# EAGLE design IMU (EAGLE 9.6.2)
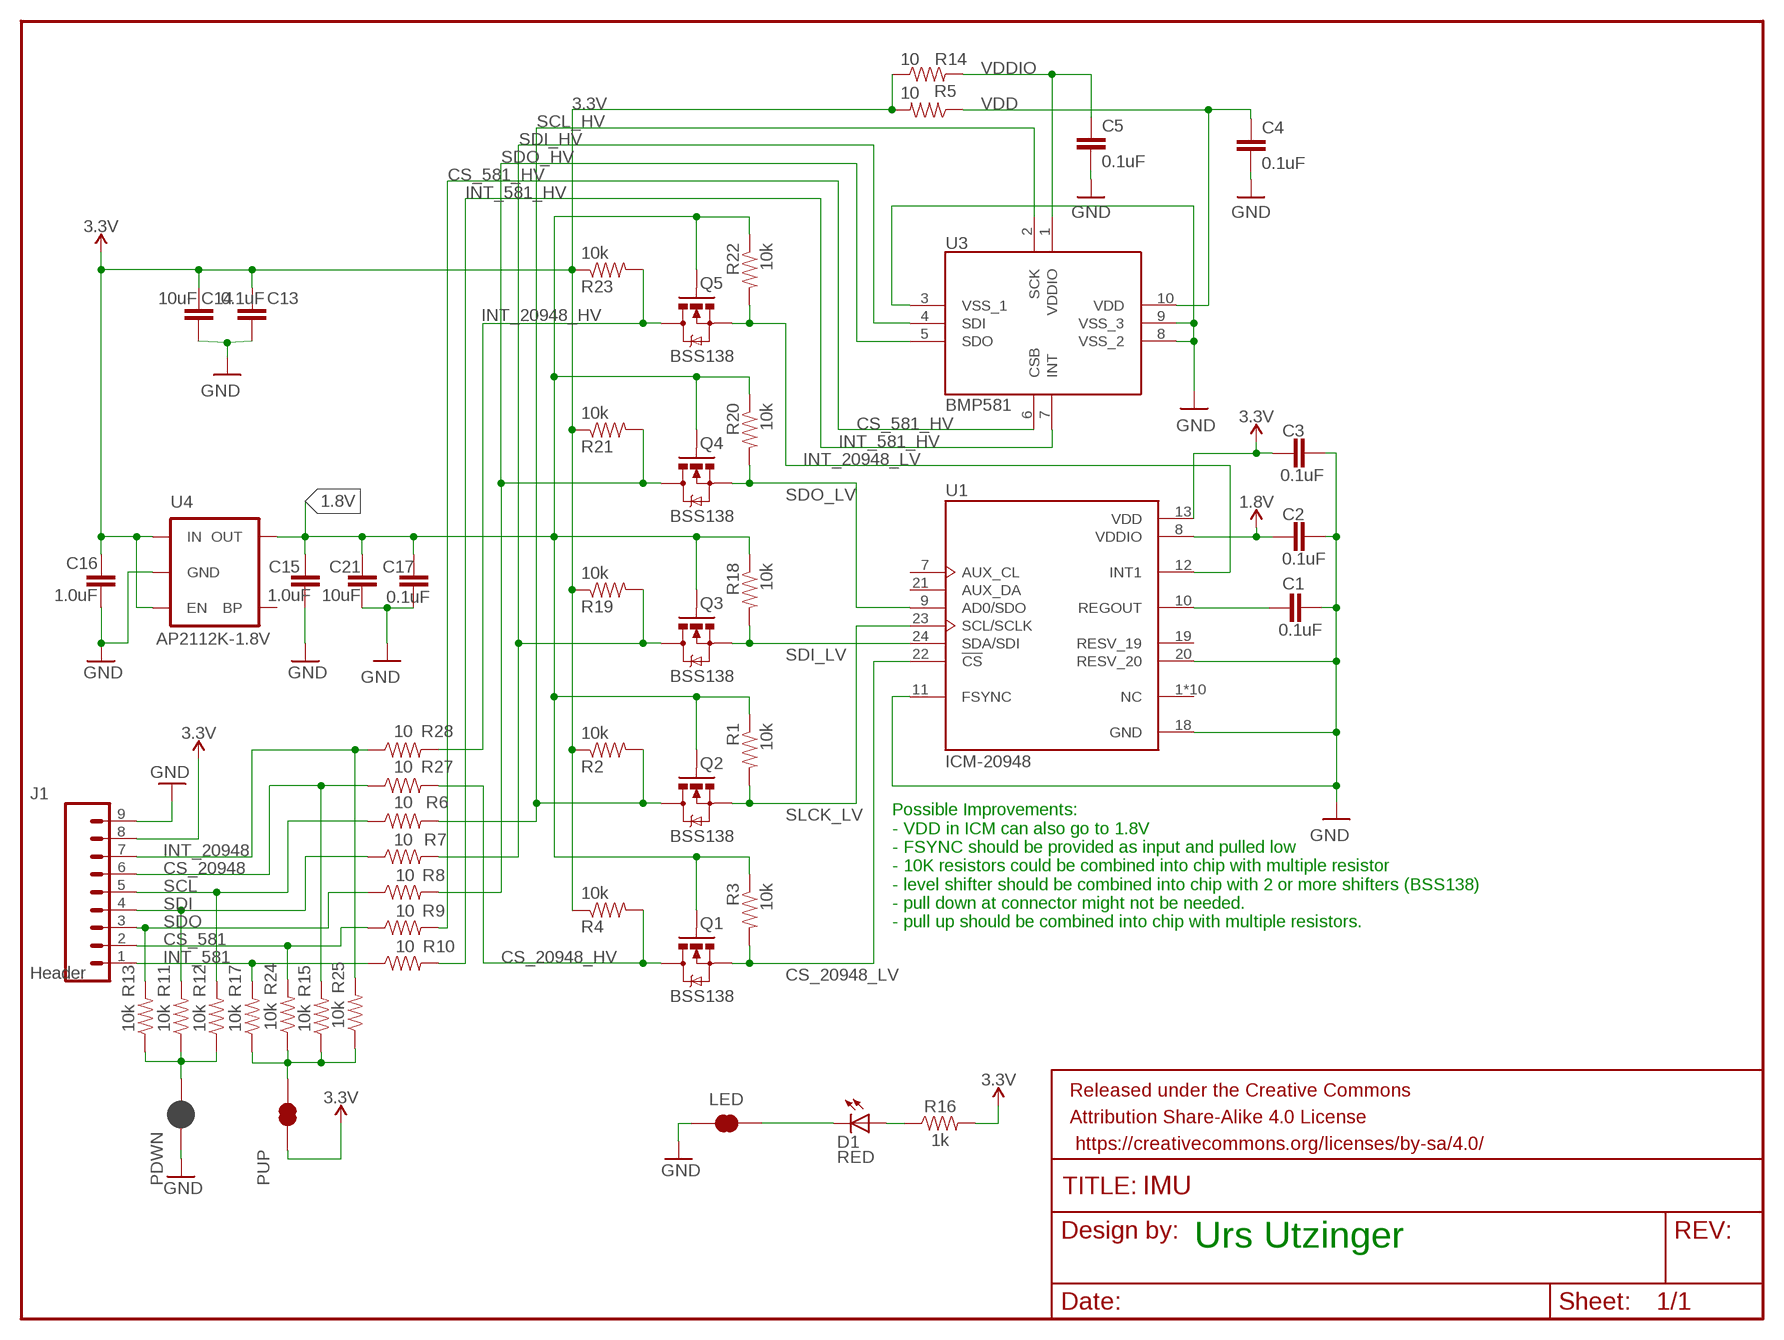
[diagram p0: schematic, sheet 1]

## Parts
C1  0.1uF  0.1UF-0603-25V-(+80/-20%)  [0603]
C2  0.1uF  0.1UF-0603-25V-(+80/-20%)  [0603]
C3  0.1uF  0.1UF-0603-25V-(+80/-20%)  [0603]
C4  0.1uF  0.1UF-0603-25V-(+80/-20%)  [0603]
C5  0.1uF  0.1UF-0603-25V-(+80/-20%)  [0603]
C13  0.1uF  0.1UF-0603-25V-(+80/-20%)  [0603]
C14  10uF  10UF-0603-6.3V-20%  [0603@1]
C15  1.0uF  1.0UF-0603-16V-10%  [0603]
C16  1.0uF  1.0UF-0603-16V-10%  [0603]
C17  0.1uF  0.1UF-0603-25V-(+80/-20%)  [0603]
C21  10uF  10UF-0603-6.3V-20%  [0603@1]
D1  RED  LED-RED0603  [LED-0603]
FRAME1  FRAME-LETTERNO_PACKAGE  [DUMMY]
J1  Header  CONN_09  [1X09]
LED  LED ENABLE  JUMPER-SMT_2_NC_TRACE_SILK  [SMT-JUMPER_2_NC_TRACE_SILK]
PDWN  JUMPER-SMT_2_NC_PASTE_SILK  [SMT-JUMPER_2_NC_PASTE_SILK]
PUP  JUMPER-SMT_2_NC_TRACE_SILK  [SMT-JUMPER_2_NC_TRACE_SILK]
Q1  BSS138  SPARKFUN_MOSFET-NCHANNELSMD  [SPARKFUN_SOT23-3]
Q2  BSS138  SPARKFUN_MOSFET-NCHANNELSMD  [SPARKFUN_SOT23-3]
Q3  BSS138  SPARKFUN_MOSFET-NCHANNELSMD  [SPARKFUN_SOT23-3]
Q4  BSS138  SPARKFUN_MOSFET-NCHANNELSMD  [SPARKFUN_SOT23-3]
Q5  BSS138  SPARKFUN_MOSFET-NCHANNELSMD  [SPARKFUN_SOT23-3]
R1  10k  10KOHM-0603-1/10W-1%  [0603]
R2  10k  10KOHM-0603-1/10W-1%  [0603]
R3  10k  10KOHM-0603-1/10W-1%  [0603]
R4  10k  10KOHM-0603-1/10W-1%  [0603]
R5  10  10OHM-0603-1/10W-5%  [0603]
R6  10  10OHM-0603-1/10W-1%  [0603]
R7  10  10OHM-0603-1/10W-1%  [0603]
R8  10  10OHM-0603-1/10W-1%  [0603]
R9  10  10OHM-0603-1/10W-1%  [0603]
R10  10  10OHM-0603-1/10W-1%  [0603]
R11  10k  10KOHM-0603-1/10W-1%  [0603]
R12  10k  10KOHM-0603-1/10W-1%  [0603]
R13  10k  10KOHM-0603-1/10W-1%  [0603]
R14  10  10OHM-0603-1/10W-5%  [0603]
R15  10k  10KOHM-0603-1/10W-1%  [0603]
R16  1k  1KOHM-0603-1/10W-1%  [0603]
R17  10k  10KOHM-0603-1/10W-1%  [0603]
R18  10k  10KOHM-0603-1/10W-1%  [0603]
R19  10k  10KOHM-0603-1/10W-1%  [0603]
R20  10k  10KOHM-0603-1/10W-1%  [0603]
R21  10k  10KOHM-0603-1/10W-1%  [0603]
R22  10k  10KOHM-0603-1/10W-1%  [0603]
R23  10k  10KOHM-0603-1/10W-1%  [0603]
R24  10k  10KOHM-0603-1/10W-1%  [0603]
R25  10k  10KOHM-0603-1/10W-1%  [0603]
R27  10  10OHM-0603-1/10W-1%  [0603]
R28  10  10OHM-0603-1/10W-1%  [0603]
U1  ICM-20948  [QFN40P300X300X105-24N]
U3  BMP581  [BMP581]
U4  AP2112K-1.8V  AP2122K-1.8TRG1SMD  [SPARKFUN-POWERIC_SOT23-5]

## Nets
1.8V: C2.1 C15.2 C17.1 C21.1 Q1.1(G) Q2.1(G) Q3.1(G) Q4.1(G) Q5.1(G) R1.1 R3.1 R18.1 R20.1 R22.1 U1.8(VDDIO) U4.5(OUT)
3.3V: C3.1 C13.1 C14.1 C16.2 J1.8 PUP.1 R2.1 R4.1 R5.2 R14.1 R16.2 R19.1 R21.1 R23.1 U1.13(VDD) U4.1(IN) U4.3(EN)
CS_581: J1.2 R9.1 R24.2
CS_581_HV: R9.2 U3.6(CSB)
CS_20948: J1.6 R15.2 R27.1
CS_20948_HV: Q1.3(D) R4.2 R27.2
CS_20948_LV: Q1.2(S) R3.2 U1.22(!CS)
GND: C1.2 C2.2 C3.2 C4.2 C5.2 C13.2 C14.2 C15.1 C16.1 C17.2 C21.2 J1.9 LED.1 PDWN.1 U1.11(FSYNC) U1.18(GND) U1.20(RESV_20) U3.3(VSS_1) U3.8(VSS_2) U3.9(VSS_3) U4.2(GND)
INT_581: J1.1 R10.1 R17.2
INT_581_HV: R10.2 U3.7(INT)
INT_20948: J1.7 R25.2 R28.1
INT_20948_HV: Q5.3(D) R23.2 R28.2
INT_20948_LV: Q5.2(S) R22.2 U1.12(INT1)
N$3: C1.1 U1.10(REGOUT)
N$26: D1.A R16.1
N$28: D1.C LED.2
N$29: PDWN.2 R11.1 R12.1 R13.1
N$30: PUP.2 R15.1 R17.1 R24.1 R25.1
SCL: J1.5 R6.1 R12.2
SCL_HV: Q2.3(D) R2.2 R6.2 U3.2(SCK)
SDI: J1.4 R7.1 R11.2
SDI_HV: Q3.3(D) R7.2 R19.2 U3.4(SDI)
SDI_LV: Q3.2(S) R18.2 U1.24(SDA/SDI)
SDO: J1.3 R8.1 R13.2
SDO_HV: Q4.3(D) R8.2 R21.2 U3.5(SDO)
SDO_LV: Q4.2(S) R20.2 U1.9(AD0/SDO)
SLCK_LV: Q2.2(S) R1.2 U1.23(SCL/SCLK)
VDD: C4.1 R5.1 U3.10(VDD)
VDDIO: C5.1 R14.2 U3.1(VDDIO)
Unconnected: U1.1(NC) U1.2(NC) U1.3(NC) U1.4(NC) U1.5(NC) U1.6(NC) U1.7(AUX_CL) U1.14(NC) U1.15(NC) U1.16(NC) U1.17(NC) U1.19(RESV_19) U1.21(AUX_DA) U4.4(BP)

## Notes on the sheet
- Possible Improvements:
  - VDD in ICM can also go to 1.8V
  - FSYNC should be provided as input and pulled low
  - 10K resistors could be combined into chip with multiple resistor
  - level shifter should be combined into chip with 2 or more shifters (BSS138)
  - pull down at connector might not be needed.
  - pull up should be combined into chip with multiple resistors.
- Urs Utzinger

## Library data of the parts
C1-C5 C13 C17 = SparkFun-Capacitors:0.1UF: 0.1µF ceramic capacitors A capacitor is a passive two-terminal electrical component used to store electrical energy temporarily in an electric field.; PROD_ID: CAP-00810
C14 C21 = SparkFun-Capacitors:10UF: 10.0µF ceramic capacitors A capacitor is a passive two-terminal electrical component used to store electrical energy temporarily in an electric field.; PROD_ID: CAP-11015
C15 C16 = SparkFun-Capacitors:1.0UF: 1µF ceramic capacitors A capacitor is a passive two-terminal electrical component used to store electrical energy temporarily in an electric field.; PROD_ID: CAP-00868
D1 = SparkFun-LED:LED-RED: Assorted Red LEDs LilyPad 1206- DIO-09912 1206- DIO-00809 0603- DIO-00819; PROD_ID: DIO-00819
FRAME1 = SparkFun-Aesthetics:FRAME-LETTER: Schematic Frame - Letter Standard 8.5x11 US Letter frame; DESIGNER: Nobody; VERSION: v01
J1 = SparkFun-Connectors:CONN_09: Multi connection point. Often used as Generic Header-pin footprint for 0.1 inch spaced/style header connections On any of the 0.1 inch spaced packages, you can populate with these: Break Away Headers - Straight <https://www.sparkfun.com/products/116> (PRT-00116) Break Away Male Headers - Right Angle <https://www.sparkfun.com/products/553> (PRT-00553) Female Headers <https://www.sparkfun.com/products/115> (PRT-00115) Break Away Headers - Machine Pin <https://www.sparkfun.com/products/117> (PRT-00117) Break Away Female Headers - Swiss Machine Pin <https://www.sparkfun.com/products/743> (PRT-00743) For SCREWTERMINALS and SPRING TERMINALS visit here: Screw Terimnals on SparkFun.com <https://www.sparkfun.com/search/results?term=Screw+Terminals> (5mm/3.5mm/2.54mm spacing) This device is also useful as a general connection point to wire up your design to another part of your project. Our various solder wires solder well into these plated through hole pads. Hook-Up Wire - Assortment (Stranded, 22 AWG) <https://www.sparkfun.com/products/11375> (PRT-11375) Hook-Up Wire - Assortment (Solid Core, 22 AWG) <https://www.sparkfun.com/products/11367> (PRT-11367) View the entire wire category on our website here <https://www.sparkfun.com/categories/141> Special notes: Molex polarized connector foot print use with SKU : PRT-08231 with associated crimp pins and housings. 1MM SMD Version SKU: PRT-10208 NOTES ON THE VARIANTS LOCK and LOCK_LONGPADS... This footprint was designed to help hold the alignment of a through-hole component (i.e. 6-pin header) while soldering it into place. You may notice that each hole has been shifted either up or down by 0.005 of an inch from it's more standard position (which is a perfectly straight line). This slight alteration caused the pins (the squares in the middle) to touch the edges of the holes. Because they are alternating, it causes a "brace" to hold the component in place. 0.005 has proven to be the perfect amount of "off-center" position when using our standard breakaway headers. Although looks a little odd when you look at the bare footprint, once you have a header in there, the alteration is very hard to notice. Also,if you push a header all the way into place, it is covered up entirely on the bottom side.
LED PUP = SparkFun-Jumpers:JUMPER-SMT_2_NC_TRACE: Normally closed trace jumper This jumper has a trace between two pads so it's normally closed (NC). Use a razor knife to open the connection. For best results follow the IPC guidelines for cutting traces: Cutout at least 0.063 mm (0.005 in). Remove all loose material to clean up the cut area. Seal the cut with an approved epoxy. Reapply solder to reclose the connection.
PDWN = SparkFun-Jumpers:JUMPER-SMT_2_NC_PASTE: Normally closed solder jumper This jumper has an aperture in the stencil to allow solder paste to bridge the split in the wire so it's normally closed (NC). Wick off the solder to open the connection. Reapply solder to reclose the connection.
Q1-Q5 = BSS138:SPARKFUN_MOSFET-NCHANNEL
R1-R4 R11-R13 R15 R17-R25 = SparkFun-Resistors:10KOHM: 10kΩ resistor A resistor is a passive two-terminal electrical component that implements electrical resistance as a circuit element. Resistors act to reduce current flow, and, at the same time, act to lower voltage levels within circuits. - Wikipedia; PROD_ID: RES-00824
R5 R14 = SparkFun-Resistors:10OHM: 10Ω resistor A resistor is a passive two-terminal electrical component that implements electrical resistance as a circuit element. Resistors act to reduce current flow, and, at the same time, act to lower voltage levels within circuits. - Wikipedia; PROD_ID: RES-09834
R6-R10 R27 R28 = SparkFun-Resistors:10OHM: 10Ω resistor A resistor is a passive two-terminal electrical component that implements electrical resistance as a circuit element. Resistors act to reduce current flow, and, at the same time, act to lower voltage levels within circuits. - Wikipedia; PROD_ID: RES-12581
R16 = SparkFun-Resistors:1KOHM: 1kΩ resistor A resistor is a passive two-terminal electrical component that implements electrical resistance as a circuit element. Resistors act to reduce current flow, and, at the same time, act to lower voltage levels within circuits. - Wikipedia; PROD_ID: RES-07856
U1 = ICM-20948:ICM-20948: Accelerometer, Gyroscope, Magnetometer, 9 Axis Sensor I²C, SPI Output; MANUFACTURER: TDK InvenSense; MAXIMUM_PACKAGE_HEIGHT: 1.05 mm; PARTREV: 1.3; STANDARD: IPC 7351B
U3 = BMP581:BMP581: Pressure Sensor 4.35PSI ~ 18.13PSI (30kPa ~ 125kPa) Absolute 10-WFLGA Source: Datasheet <https://www.bosch-sensortec.com/media/boschsensortec/downloads/datasheets/bst-bmp581-ds004.pdf>; DESCRIPTION: Pressure Sensor 4.35PSI ~ 18.13PSI (30kPa ~ 125kPa) Absolute 10-WFLGA; HEIGHT: 0.8mm; MANUFACTURER_NAME: BOSCH; MANUFACTURER_PART_NUMBER: BMP581; MOUSER_PART_NUMBER: 262-BMP581; MOUSER_PRICE-STOCK: https://www.mouser.co.uk/ProductDetail/Bosch-Sensortec/BMP581?qs=Li%252BoUPsLEntPL9tlFmcgXg%3D%3D
U4 = AP2112K-1.8TRG1:AP2122K-1.8TRG1: Voltage Regulator LDO Standard 150mA LDO voltage regulator in SOT-23 layout. Micrel part MIC5205. BP (by-pass) pin is used to lower output noise with 470pF cap.; PROD_ID: VREG-12457

## Board
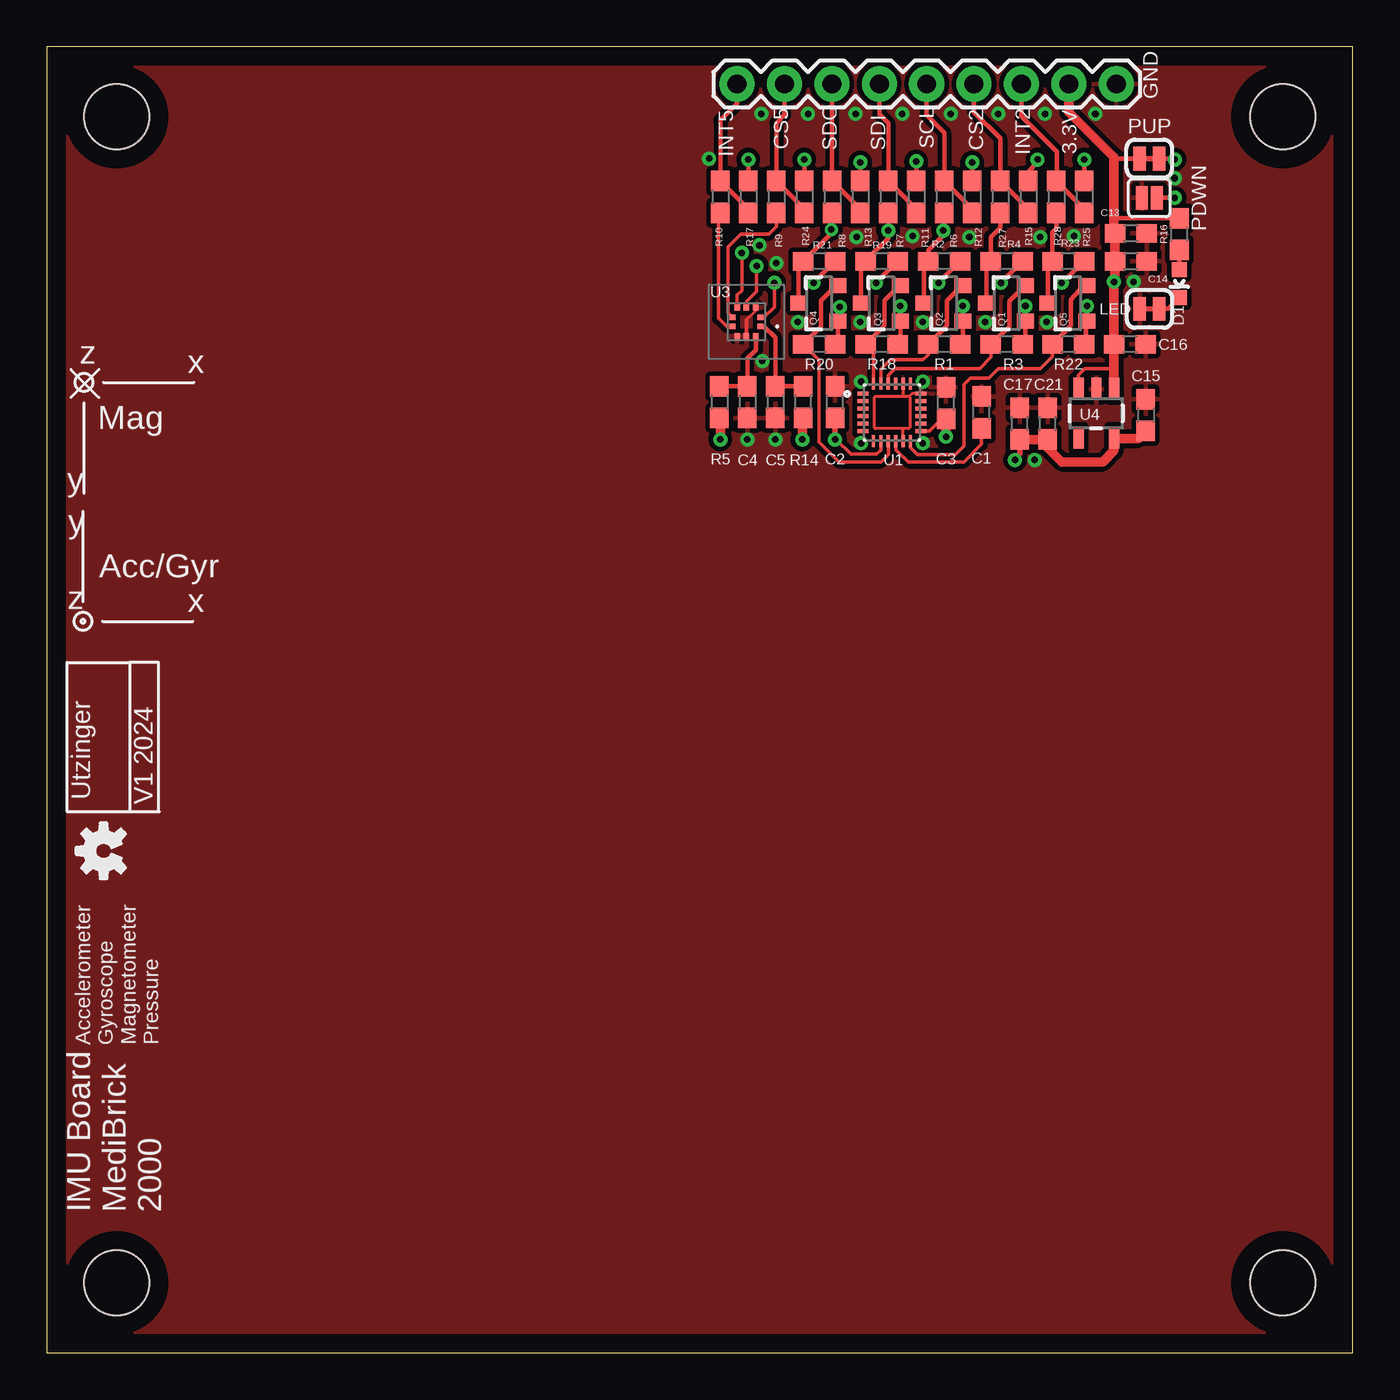
[diagram p1: board, top side]
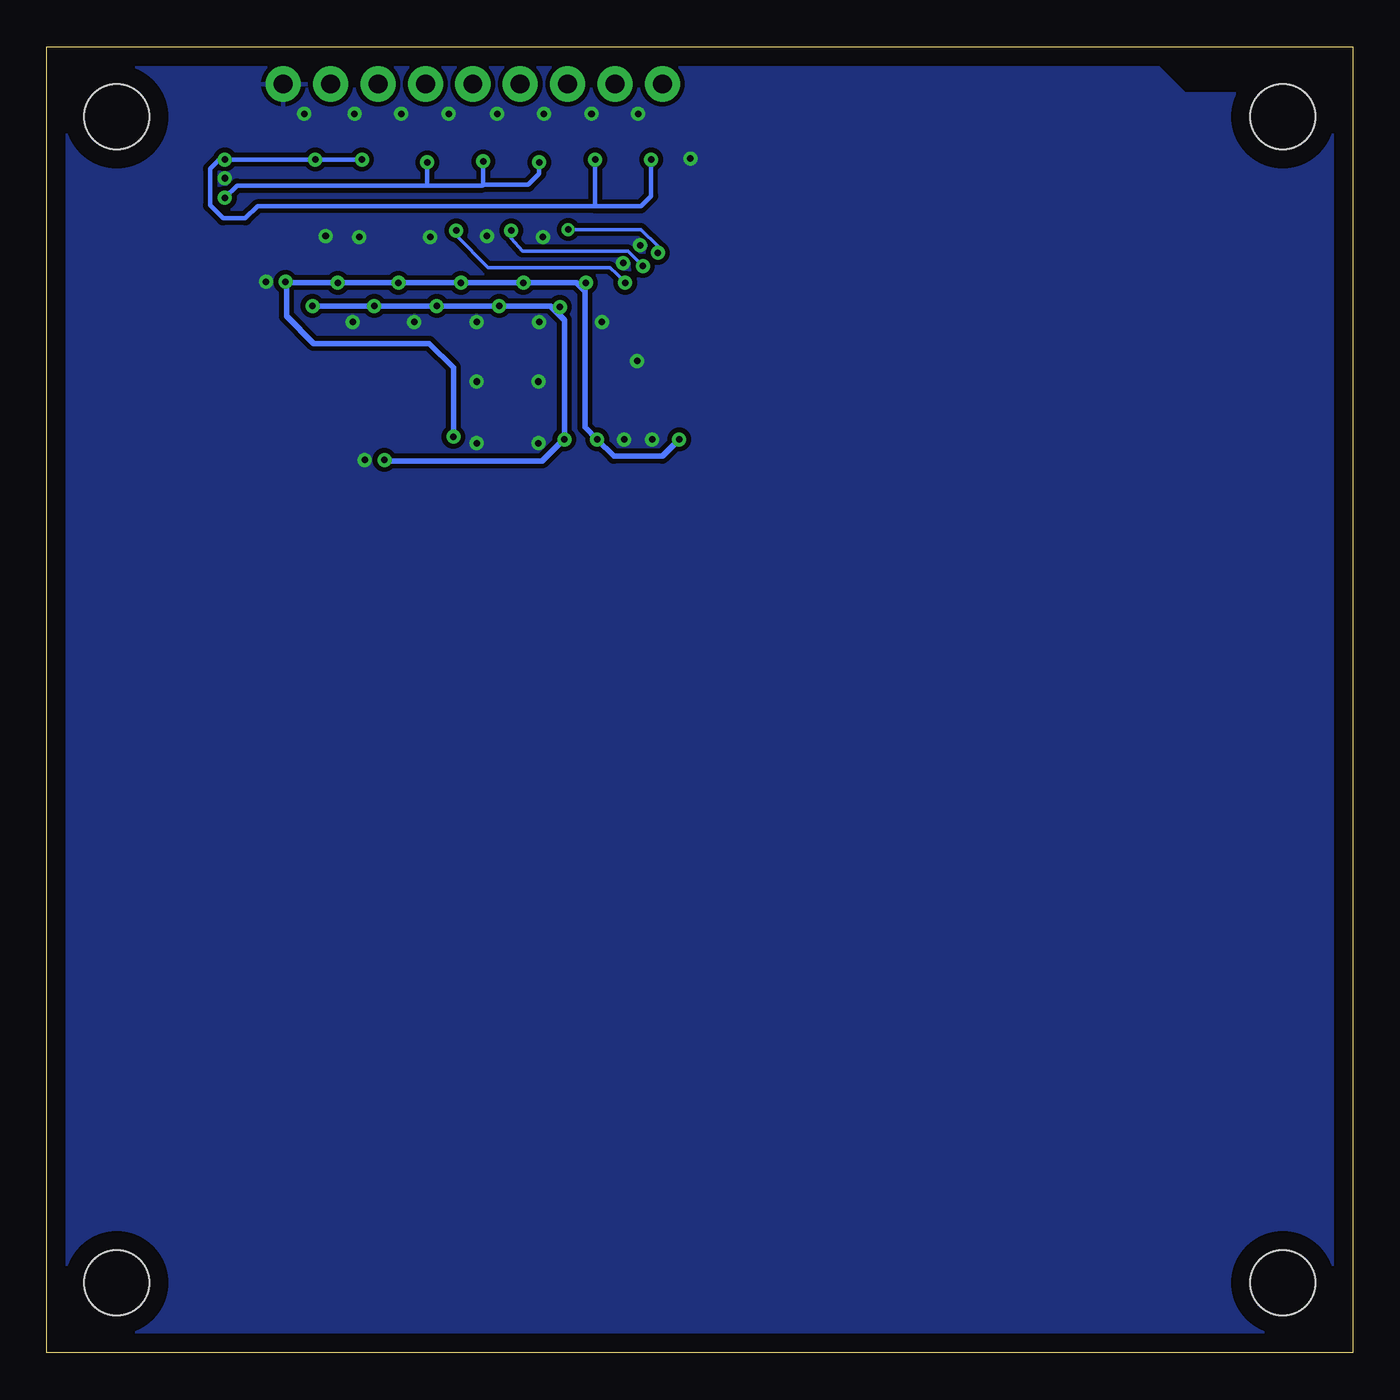
[diagram p2: board, bottom side, seen from below]

Size 70 x 70 mm. Coordinates in mm from the lower left corner, seen from the top.
Outline: 0,0 70,0 70,70 0,70 0,0
Copper layers (1*16): Top 0.035mm / dielectric 1.5mm / Bottom 0.035mm
Design rules "default *": minimum track width 4mil, minimum drill 0.1mm, track to track 6mil, track to pad 3mil, pad to pad 6mil, via to via 3mil, smd to smd 3mil, copper to edge 40mil, drill to drill 6mil, minimum pad ring 3mil, minimum via ring 2mil, stop-mask expansion 3mil, vias tented up to drill 15mil, thermal gap 10mil
Holes 3.5 mm at 3.75,66.25 66.25,66.25 3.75,3.75 66.25,3.75

### Footprints (pad centres in the part's own frame; a part is rotated, then mirrored left to right if it is on the bottom)
0603 = smd 1.1 x 1: 1 -0.85,0; 2 0.85,0
0603@1 = smd 1.1 x 1: 1 -0.85,0; 2 0.85,0
LED-0603 = smd 0.8 x 0.8: A 0,-0.75; C 0,0.75
1X09 = drill 1.016 pad 1.88: 1 0,0; 2 2.54,0; 3 5.08,0; 4 7.62,0; 5 10.16,0; 6 12.7,0; 7 15.24,0; 8 17.78,0; 9 20.32,0
SMT-JUMPER_2_NC_TRACE_SILK = smd 0.66 x 1.27: 1 -0.521,0; 2 0.521,0
SMT-JUMPER_2_NC_PASTE_SILK = smd 0.635 x 1.27: 1 -0.406,0; 2 0.406,0
SPARKFUN_SOT23-3 = smd 0.8 x 0.9: 1 -0.95,-1; 2 0.95,-1; 3 0,1.1
QFN40P300X300X105-24N = smd 0.64 x 0.22: 1 -1.545,1; 2 -1.545,0.6; 3 -1.545,0.2; 4 -1.545,-0.2; 5 -1.545,-0.6; 6 -1.545,-1; 13 1.545,-1; 14 1.545,-0.6; 15 1.545,-0.2; 16 1.545,0.2; 17 1.545,0.6; 18 1.545,1 | smd 0.22 x 0.64: 7 -1,-1.545; 8 -0.6,-1.545; 9 -0.2,-1.545; 10 0.2,-1.545; 11 0.6,-1.545; 12 1,-1.545; 19 1,1.545; 20 0.6,1.545; 21 0.2,1.545; 22 -0.2,1.545; 23 -0.6,1.545; 24 -1,1.545
BMP581 = smd 0.325 x 0.3: 1 -0.75,0.25; 2 -0.75,-0.25; 6 0.75,-0.25; 7 0.75,0.25 | smd 0.3 x 0.325: 3 -0.5,-0.775; 4 0,-0.775; 5 0.5,-0.775; 8 0.5,0.775; 9 0,0.775; 10 -0.5,0.775
SPARKFUN-POWERIC_SOT23-5 = smd 0.55 x 1.2: 1 -0.95,-1.3; 2 0,-1.3; 3 0.95,-1.3; 4 0.95,1.3; 5 -0.95,1.3

### Placement (x,y rotation side)
C1  50.1,50.4 90 top
C2  42.25,50.95 90 top
C3  48.2,50.9 90 top
C4  37.55,50.95 270 top
C5  39.05,50.95 270 top
C13  58.1,60 0 top
C14  58.1,58.5 0 top
C15  58.9,50.25 270 top
C16  58.05,54.05 180 top
C17  52.15,49.8 90 top
C21  53.65,49.8 90 top
D1  60.7,57.3 180 top
FRAME1  -0.2,0.2 0 top
J1  37,68 0 top
LED  59.1,55.95 0 top
PDWN  59.09,61.9 0 top
PUP  59.09,64 0 top
Q1  51.45,56.25 90 top
Q2  48.1,56.25 90 top
Q3  44.75,56.25 90 top
Q4  41.4,56.25 90 top
Q5  54.75,56.25 90 top
R1  48.1,54.05 180 top
R2  48.1,58.5 180 top
R3  51.45,54.05 180 top
R4  51.45,58.5 180 top
R5  36.05,50.95 270 top
R6  48.1,61.95 270 top
R7  45.1,61.95 270 top
R8  42.1,61.95 270 top
R9  39.1,61.95 270 top
R10  36.1,61.95 270 top
R11  46.6,61.95 270 top
R12  49.6,61.95 270 top
R13  43.6,61.95 270 top
R14  40.55,50.95 90 top
R15  52.6,61.95 270 top
R16  60.7,59.95 90 top
R17  37.6,61.95 270 top
R18  44.75,54.05 180 top
R19  44.75,58.5 180 top
R20  41.4,54.05 180 top
R21  41.4,58.5 180 top
R22  54.75,54.05 180 top
R23  54.75,58.5 180 top
R24  40.6,61.95 270 top
R25  55.6,61.95 270 top
R27  51.1,61.95 270 top
R28  54.1,61.95 270 top
U1  45.3,50.4 0 top
U3  37.5,55.25 180 top
U4  56.25,50.35 180 top
U$1  [OSHW-LOGO-S]  3.05,26.9 90 top

### Tracks (layer width: path | path; a pad name or v marks a point on that pad's centre or on a via)
1.8V  (via drill 0.35 pad 0.75)
  Top 0.2: v42.25,48.95 42.3,48.95 43.1,48.15 44.46,48.15 44.7,48.39 U1.8
  Top 0.254: v52.45,56.1 Q1.1 52.45,54.2 R3.1 | R22.1 55.65,54.1 Q5.1 v55.75,56.1 | v49.1,56.1 Q2.1 49.1,54.2 R1.1 | v45.75,56.1 Q3.1 45.75,54.2 R18.1 | R20.1 42.4,54.2 Q4.1 42.4,55.95 v42.5,56.05
  Top 0.305: 51.9,47.95 52.15,48.2 C17.1 | v42.25,48.95 C2.1
  Top 0.508: C15.2 58.5,49 57.25,49 U4.5 57.2,48.35 56.6,47.75 54.4,47.75 53.65,48.5 C21.1 C17.1 | 51.9,47.95 v51.9,47.85
  Bottom 0.305: v55.75,56.1 v52.45,56.1 v49.1,56.1 v45.75,56.1 43,56.1 42.7,55.8 | 42.3,48.95 43.45,47.8 51.85,47.8 v51.9,47.85 | v42.25,48.95 42.25,55.35 42.7,55.8 | v42.5,56.05 42.7,55.85 42.7,55.8
  Bottom 0.508: v42.25,48.95 42.3,48.95
3.3V  (via drill 0.35 pad 0.75)
  Top 0.2: U1.13 47.3,49.4 47.95,50.05 C3.1 | U4.3 55.3,52.4 55.65,52.75 57.2,52.75
  Top 0.254: v51.15,57.35 R4.1 | v54.4,57.35 55.45,58.35 R23.1 | R21.1 v41.1,57.35 | R19.1 v44.45,57.35 | R2.1 v47.8,57.35 | PUP.1 57.2,64 | R16.2 60.69,60.81 57.2,60.81
  Top 0.508: J1.8 54.78,66.5 57.2,64.08 57.2,64 57.2,60.81 57.2,60.05 C13.1 C14.1 57.25,57.45 v57.2,57.4 C16.2 57.2,52.75 U4.1 | v48.2,49.1 C3.1 | v36.1,48.95 36.1,50.05 R5.2 | v40.5,48.95 40.5,50.05 R14.1
  Bottom 0.305: v48.2,49.1 48.2,52.8 49.49,54.09 55.7,54.09 57.15,55.55 57.15,57.35 v54.4,57.35 v51.15,57.35 v47.8,57.35 v44.45,57.35 41.6,57.35 41.35,57.1 | 41.35,57.1 41.15,56.9 41.15,49.6 v40.5,48.95 39.6,48.05 37,48.05 v36.1,48.95 | v41.1,57.35 41.35,57.1
  Bottom 0.508: 57.15,57.35 v57.2,57.4
CS_581
  Top 0.254: J1.2 39.54,66.34 39.1,65.9 R9.1 40.6,61.3 R24.2
CS_581_HV
  Top 0.2: R9.2 39.1,60.35 38.7,59.95 37.2,59.95 36.5,59.25 36.5,55.75 U3.6
CS_20948
  Top 0.2: 52.6,61.3 R15.2
  Top 0.254: J1.6 49.7,66.5 51.1,65.1 R27.1 52.6,61.3
CS_20948_HV
  Top 0.254: Q1.3 50.35,58.25 R4.2 50.6,59.8 51.1,60.3 R27.2
CS_20948_LV
  Top 0.2: R3.2 50.6,53.35 50,52.75 45.45,52.75 45.1,52.4 U1.22
  Top 0.254: Q1.2 51.6,56.35 51.6,55 R3.2
GND  (via drill 0.35 pad 0.75)
  Top 0.15: U3.3 38,55.86 37.5,55.36 | 46.25,51.21 46.25,49.59 46.19,49.53 45.9,49.53 | 45.9,49.53 44.41,49.53 44.35,49.59 44.35,51.21 44.41,51.27 45.9,51.27 | 45.9,51.27 46.19,51.27 46.22,51.24 46.37,51.4 U1.18 | U1.11 45.9,49.53 | U1.20 45.9,51.27
  Top 0.2: U1.20 45.91,51.93 45.91,51.67 | U3.9 37.5,55.36 | U1.18
  other vias: 51,66.4 48.45,66.4 45.85,66.4 43.35,66.4 40.8,66.4 38.3,66.4 35.5,64 50.3,55.25 53.6,55.25 40.25,55.25 43.6,55.25 46.95,55.25 52.95,47.85 46.4,59.85 49.45,59.8 43.4,59.8 43.65,48.75 46.95,48.75 46.95,52.05 43.65,52.05 39.05,48.95 37.55,48.95 58.25,57.4 38.35,53.15 60.45,62.95 39.1,58.4 38.2,59.35 53.5,66.4 53.25,59.8 55.05,59.85 56.2,66.4
  pour Top (isolate 0.254): 0,70 0,0 70,0 70,70 51.15,70 28,70
  pour Bottom (isolate 0.254): 0,67.5 0,0 70,0 70,70 11.5,70 9,67.5
INT_581
  Top 0.254: J1.1 37,66.95 36.1,66.05 R10.1 37.6,61.3 R17.2
INT_581_HV
  Top 0.2: 36,61 36,55.45 36.45,55 U3.7
  Top 0.254: R10.2 36,61
INT_20948
  Top 0.254: J1.7 52.24,66.26 54.13,64.37 54.13,62.83 R28.1 55.6,61.3 R25.2
INT_20948_HV
  Top 0.254: Q5.3 53.65,58.23 53.64,58.35 R23.2 53.9,60.05 54.1,60.25 R28.2
INT_20948_LV
  Top 0.2: U1.12 46.3,48.51 46.66,48.15 48.7,48.15 49.15,48.6 49.15,51.9 49.5,52.25 50.5,52.25 51,52.75 53.25,52.75 53.9,53.4 R22.2
  Top 0.254: Q5.2 55.55,57.2 54.9,56.45 54.9,55.05 R22.2
N$3
  Top 0.2: U1.10 45.5,48.39 46.18,47.75 49.15,47.75 50.1,48.7 C1.1
N$26
  Top 0.254: R16.1 D1.A
N$28
  Top 0.254: D1.C 60.1,55.95 LED.2
N$29  (via drill 0.35 pad 0.75)
  Top 0.254: R13.1 v43.6,63.8 | R11.1 v46.6,63.85 | R12.1 v49.6,63.8 | PDWN.2 v60.45,61.9
  Bottom 0.254: v60.45,61.9 59.8,62.55 49.6,62.55 | 46.6,62.6 44.2,62.6 43.6,63.2 v43.6,63.8 | v46.6,63.85 46.6,62.6 | v49.6,63.8 49.6,62.55 | 49.6,62.55 46.65,62.55 46.6,62.6
N$30  (via drill 0.35 pad 0.75)
  Top 0.254: PUP.2 60.35,64 v60.45,63.95 | R15.1 52.6,63.3 53.1,63.8 v53.1,63.95 | R25.1 v55.6,63.95 | R24.1 v40.6,63.95 | R17.1 v37.6,63.95
  Bottom 0.254: v53.1,63.95 v55.6,63.95 v60.45,63.95 60.75,63.95 61.25,63.45 61.25,61.5 60.55,60.8 59.35,60.8 58.7,61.45 40.6,61.45 | 40.6,61.45 38.15,61.45 37.6,62 v37.6,63.95 | v40.6,63.95 40.6,61.45
SCL
  Top 0.254: J1.5 47.16,66.34 48.1,65.4 R6.1 49.6,61.3 R12.2
SCL_HV  (via drill 0.35 pad 0.75)
  Top 0.2: U3.2 38.45,55.5 39,56.05 v39,57.35
  Top 0.254: Q2.3 47,58.25 R2.2 47.25,59.1 48.05,59.9 v48.05,60.15 48.1,60.2 R6.2
  Bottom 0.2: v39,57.35 39,57.4 39.8,58.15 46.35,58.15 48.05,59.9 v48.05,60.15
SDI
  Top 0.254: J1.4 44.62,66.38 45.1,65.9 R7.1 46.6,61.3 R11.2
SDI_HV  (via drill 0.35 pad 0.75)
  Top 0.2: U3.4 37.5,56.33 38.05,56.88 v38.05,58.25
  Top 0.254: Q3.3 43.65,58.25 R19.2 43.9,58.55 45.1,59.75 v45.1,60.15 R7.2
  Bottom 0.2: v38.05,58.25 38.85,59.05 44.5,59.05 45.1,59.75 v45.1,60.15
SDI_LV
  Top 0.2: U1.24 44.3,53.65 R18.2
  Top 0.254: R18.2 44.9,55.05 44.9,56.4 45.7,57.2 Q3.2
SDO
  Top 0.254: J1.3 42.08,62.82 R8.1 43.6,61.3 R13.2
SDO_HV  (via drill 0.35 pad 0.7, 0.35 pad 0.75)
  Top 0.2: v37.25,58.95 37.25,56.92 37,56.67 U3.5
  Top 0.254: Q4.3 40.3,58.25 R21.2 42.05,60 v42.05,60.2 42.05,61.05 R8.2
  Bottom 0.2: v37.25,58.95 37.25,59.3 38.15,60.2 v42.05,60.2
SDO_LV
  Top 0.2: R20.2 41.4,53.2 41.4,48.8 42.45,47.75 44.71,47.75 45.1,48.14 U1.9
  Top 0.254: R20.2 41.5,55 41.5,56.4 42.3,57.2 Q4.2
SLCK_LV
  Top 0.2: U1.23 44.7,52.71 45.22,53.22 46.97,53.22 47.25,53.5 R1.2
  Top 0.254: R1.2 48.25,55.05 48.25,56.4 49.08,57.23 Q2.2
VDD
  Top 0.254: R5.1 C4.1 37.55,53.3 38,53.75 U3.10
VDDIO
  Top 0.254: U3.1 38.45,55 39.05,54.4 C5.1 R14.2

### Text on the board
tPlace: GND | SCL | INT5 | CS5 | SDO | SDI | CS2 | INT2 | 3.3V | z | x | Mag | y | y | Acc/Gyr | z | x | Accelerometer / Gyroscope / Magnetometer / Pressure
tNames: Utzinger | V1 2024 | IMU Board / MediBrick / 2000